# Altium schematic sheet 15-100M_ClkBuffer.SchDoc
size B; SheetNumber: 15; SheetTotal: 16
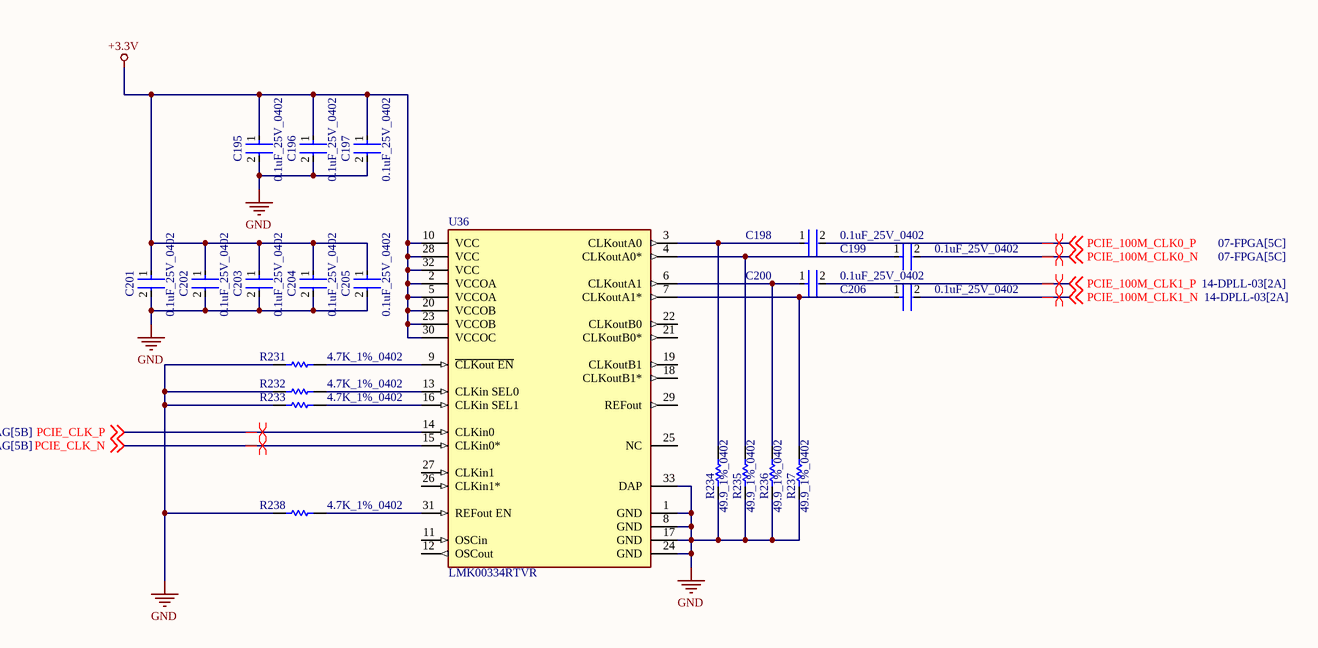
[diagram p0: 15-100M_ClkBuffer.SchDoc]

## Parts
C195  0.1uF_25V_0402  [FP-0402-L_1_0_1-W_0_5_0_1-IPC_C]
C196  0.1uF_25V_0402  [FP-0402-L_1_0_1-W_0_5_0_1-IPC_C]
C197  0.1uF_25V_0402  [FP-0402-L_1_0_1-W_0_5_0_1-IPC_C]
C198  0.1uF_25V_0402  [FP-0402-L_1_0_1-W_0_5_0_1-IPC_C]
C199  0.1uF_25V_0402  [FP-0402-L_1_0_1-W_0_5_0_1-IPC_C]
C200  0.1uF_25V_0402  [FP-0402-L_1_0_1-W_0_5_0_1-IPC_C]
C201  0.1uF_25V_0402  [FP-0402-L_1_0_1-W_0_5_0_1-IPC_C]
C202  0.1uF_25V_0402  [FP-0402-L_1_0_1-W_0_5_0_1-IPC_C]
C203  0.1uF_25V_0402  [FP-0402-L_1_0_1-W_0_5_0_1-IPC_C]
C204  0.1uF_25V_0402  [FP-0402-L_1_0_1-W_0_5_0_1-IPC_C]
C205  0.1uF_25V_0402  [FP-0402-L_1_0_1-W_0_5_0_1-IPC_C]
C206  0.1uF_25V_0402  [FP-0402-L_1_0_1-W_0_5_0_1-IPC_C]
R231  4.7K_1%_0402  [RESC1005X40X25NL10T10]
R232  4.7K_1%_0402  [RESC1005X40X25NL10T10]
R233  4.7K_1%_0402  [RESC1005X40X25NL10T10]
R234  49.9_1%_0402  [RESC1005X40X25NL10T10]
R235  49.9_1%_0402  [RESC1005X40X25NL10T10]
R236  49.9_1%_0402  [RESC1005X40X25NL10T10]
R237  49.9_1%_0402  [RESC1005X40X25NL10T10]
R238  4.7K_1%_0402  [RESC1005X40X25NL10T10]
U36  LMK00334RTVR  [FP-RTV0032A-MFG]

## Nets
+3.3V: C195.1 C196.1 C197.1 C201.1 C202.1 C203.1 C204.1 C205.1 U36.2(VCCOA) U36.5(VCCOA) U36.10(VCC) U36.20(VCCOB) U36.23(VCCOB) U36.28(VCC) U36.30(VCCOC) U36.32(VCC)
GND: C195.2 C196.2 C197.2 C201.2 C202.2 C203.2 C204.2 C205.2 R231.2 R232.2 R233.2 R234.1 R235.1 R236.1 R237.1 R238.2 U36.1(GND) U36.8(GND) U36.17(GND) U36.24(GND) U36.33(DAP)
PCIE_100M_CLK0_N: C199.2 ; off-sheet PCIE_100M_CLK0_N
PCIE_100M_CLK0_P: C198.2 ; off-sheet PCIE_100M_CLK0_P
PCIE_100M_CLK1_N: C206.2 ; off-sheet PCIE_100M_CLK1_N
PCIE_100M_CLK1_P: C200.2 ; off-sheet PCIE_100M_CLK1_P
PCIE_CLK_N: U36.15(CLKin0*) ; off-sheet PCIE_CLK_N
PCIE_CLK_P: U36.14(CLKin0) ; off-sheet PCIE_CLK_P
NetC198_1: C198.1 R234.2 U36.3(CLKoutA0)
NetC199_1: C199.1 R235.2 U36.4(CLKoutA0*)
NetC200_1: C200.1 R236.2 U36.6(CLKoutA1)
NetC206_1: C206.1 R237.2 U36.7(CLKoutA1*)
NetR231_1: R231.1 U36.9(~{CLKout_EN})
NetR232_1: R232.1 U36.13(CLKin_SEL0)
NetR233_1: R233.1 U36.16(CLKin_SEL1)
NetR238_1: R238.1 U36.31(REFout_EN)

Not connected (* = marked no-connect by the designer): U36 11(OSCin) 12(OSCout) 18(CLKoutB1*) 19(CLKoutB1) 21(CLKoutB0*) 22(CLKoutB0) 25(NC) 26(CLKin1*) 27(CLKin1) 29(REFout)

## Layout directives
differential pair: PCIE_100M_CLK0_N, PCIE_100M_CLK0_P, PCIE_100M_CLK1_N, PCIE_100M_CLK1_P, PCIE_CLK_N, PCIE_CLK_P

## Library data of the parts
C195-C206 = CMP-2008-02519-2: General Purpose Ceramic Capacitor, 0402, 100nF, 10%, X7R, 15%, 25V; Package Quantity: 1; Capacitance: 100nF; Min Operating Temperature: -55°C; Voltage: 25V; Voltage Rating: 25V; Construction: Flat; Max Operating Temperature: 125°C; Radiation Hardening: No; Depth: 0.5mm; Thickness: 0.022inch; Voltage Rating (DC): 25V; Number of Pins: 2; Lead Free: Lead Free; Series: -; REACH SVHC: No SVHC; Length: 1mm; Dielectric: X7R; RoHS Compliant: Yes; Mount: Surface Mount; Packaging: Tape and Reel; Case/Package: 0402; Case Code (Imperial): 0402; Termination: SMD/SMT; Width: 0.02inch; Case Code (Metric): 1005; Tolerance: 10%
R231-R233 R238 = CMP-2002-05217-1: Manufacturer: Bourns; Part Number: CR0402-FX-4701GLF
R234-R237 = CMP-2002-04448-1: Part Number: RK73H1ETTP49R9F; Manufacturer: KOA Speer
U36 = CMP-04855-000011-1: IC CLK BUF 400MHZ 1CIRC 32WQFN; Number of Outputs: 4; Max Supply Voltage: 3.45V; PLL: No; Max Duty Cycle: 55%; Operating Supply Current: 13.5mA; Min Supply Voltage: 3.15V; Nominal Supply Current: 8.5mA; Input: Crystal; Propagation Delay: 2700ps; Operating Supply Voltage: 3.3V; Number of Circuits: 1; REACH SVHC: No SVHC; Radiation Hardening: No; RoHS Compliant: Yes; Lead Free: Lead Free; Mount: Surface Mount; Min Operating Temperature: -40°C; Package Quantity: 1000; Max Operating Temperature: 85°C; Number of Pins: 32; Max Frequency: 400MHz; Frequency: 400MHz; Packaging: Tape and Reel